# Altium schematic sheet Micron-6.SchDoc: Ультра-Микрон (Микрон-6)
size A4; Date: 03.07.2012; Author: Andrey Bykanov; Engineer: Andrey Bykanov
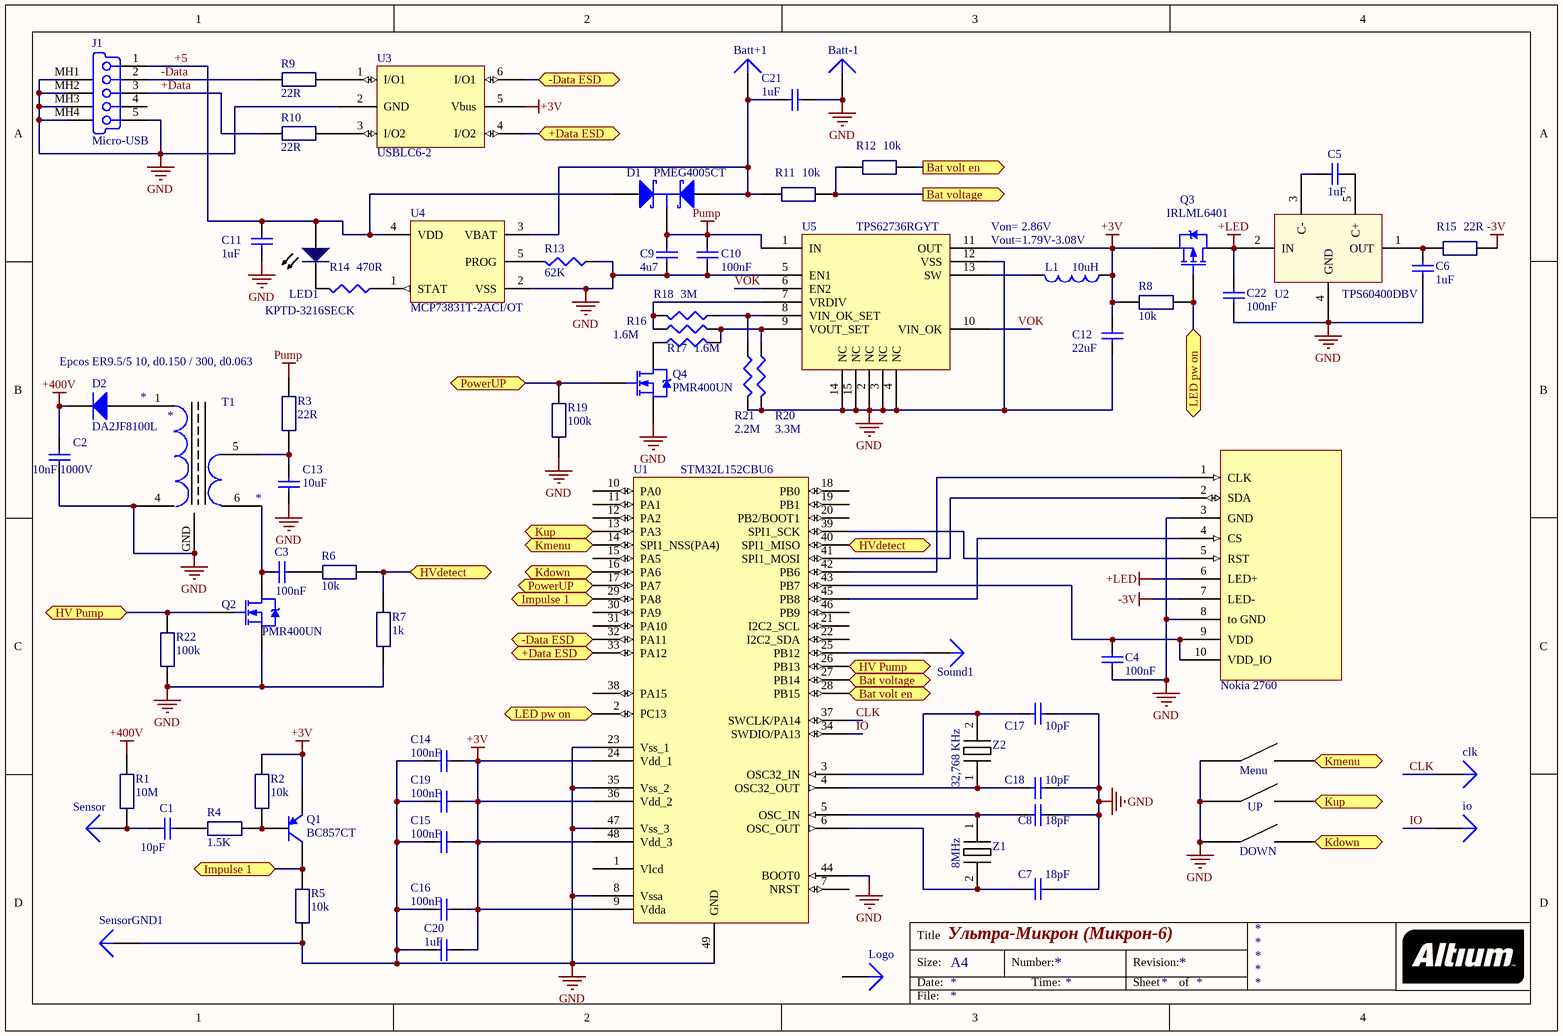
[diagram p0: Micron-6.SchDoc]

## Parts
Batt+1  (no value)  [Sensor contact]
Batt-1  (no value)  [Sensor contact]
C1  10pF  [C1206]
C2  10nF 1000V  [1812]
C3  100nF  [1608[0603]]
C4  100nF  [0402 AVX]
C5  1uF  [0402 AVX]
C6  1uF  [0402 AVX]
C7  18pF  [0402 AVX]
C8  18pF  [0402 AVX]
C9  4u7  [C1206]
C10  100nF  [C1206]
C11  1uF  [0402 AVX]
C12  22uF  [C1206]
C13  10uF  [C1206]
C14  100nF  [0402 AVX]
C15  100nF  [0402 AVX]
C16  100nF  [0402 AVX]
C17  10pF  [0402 AVX]
C18  10pF  [0402 AVX]
C19  100nF  [0402 AVX]
C20  1uF  [0402 AVX]
C21  1uF  [0402 AVX]
C22  100nF  [0402 AVX]
clk  (no value)  [Sensor contact]
D1  PMEG4005CT  [SOT23_N]
D2  DA2JF8100L  [DA2JF8100L]
Display1  Nokia 2760  [DF23C-10DS-0.5V]
io  (no value)  [Sensor contact]
J1  Micro-USB  [47346-0001]
KEY1  Menu  [IT-1187-160GM-G]
KEY2  UP  [IT-1187-160GM-G]
KEY3  DOWN  [IT-1187-160GM-G]
L1  10uH  [IFSC1515AHER100M01]
LED1  KPTD-3216SECK  [KPTD-3216SECK]
Logo  (no value)  [Logo Micron]
Q1  BC857CT  [SOT416_N]
Q2  PMR400UN  [PMR400UN]
Q3  IRLML6401  [Micro3_N]
Q4  PMR400UN  [PMR400UN]
R1  10M  [Yageo HV 1206]
R2  10k  [1608[0603]]
R3  22R  [1608[0603]]
R4  1.5K  [1608[0603]]
R5  10k  [1608[0603]]
R6  10k  [1608[0603]]
R7  1k  [1608[0603]]
R8  10k  [1608[0603]]
R9  22R  [1608[0603]]
R10  22R  [1608[0603]]
R11  10k  [1608[0603]]
R12  10k  [1608[0603]]
R13  62K  [J1-0603]
R14  470R  [1608[0603]]
R15  22R  [1608[0603]]
R16  1.6M  [J1-0603]
R17  1.6M  [J1-0603]
R18  3M  [J1-0603]
R19  100k  [1608[0603]]
R20  3.3M  [J1-0603]
R21  2.2M  [J1-0603]
R22  100k  [1608[0603]]
Sensor  (no value)  [Sensor contact]
SensorGND1  (no value)  [Sensor contact]
Sound1  (no value)  [Sensor contact]
T1  Epcos ER9.5/5 10, d0.150 / 300, d0.063  [Epcos ER9.5/5]
U1  STM32L152CBU6  [UFQFPN48_M]
U2  TPS60400DBV  [SOT-23-OT5_M]
U3  USBLC6-2  [SOT23-6L]
U4  MCP73831T-2ACI/OT  [SOT-23-OT5_N]
U5  TPS62736RGYT  [TPS62736RGYT]
Z1  8MHz  [8MHZ]
Z2  32,768 KHz  [ABS10]

## Ports
+Data ESD, +Data ESD (bidir), -Data ESD, -Data ESD (bidir), Bat volt en (out), Bat voltage (out), HV Pump, HVdetect, Impulse 1, Kdown, Kmenu, Kup, LED pw on, PowerUP

## Nets
+3V: C12.2 C14.1 C15.1 C16.1 C19.1 C20.1 L1.1 Q1.2(E) Q3.2(S) R2.1(A) R8.2 U1.9(Vdda) U1.24(Vdd_1) U1.36(Vdd_2) U1.48(Vdd_3) U3.5(Vbus) U5.11(OUT)
+400V: C2.2 D2.2(K) R1.2
+LED: C22.1 Display1.6(LED+) Q3.3(D) U2.2(IN)
-3V: Display1.7(LED-) R15.1(A)
GND: Batt-1.1 C2.1 C4.2 C6.1 C7.1 C8.2 C9.1 C10.1 C11.1 C12.1 C13.1 C14.2 C15.2 C16.2 C17.1 C18.1 C19.2 C20.2 C21.1 C22.2 Display1.3(GND) Display1.8(to_GND) J1.5(GND) J1.MH1(Tab) J1.MH2(Tab) J1.MH3(Tab) J1.MH4(Tab) KEY1.3 KEY2.3 KEY3.3 Q2.2(S) Q4.2(S) R5.2 R7.1(A) R13.1 R19.1(A) R20.2 R21.2 R22.2 SensorGND1.1 T1.4 T1.GND U1.8(Vssa) U1.23(Vss_1) U1.35(Vss_2) U1.44(BOOT0) U1.47(Vss_3) U1.49(GND) U2.4(GND) U3.2(GND) U4.2(VSS) U5.2(NC) U5.3(NC) U5.4(NC) U5.5(EN1) U5.12(VSS) U5.14(NC) U5.15(NC)
Pump: C9.2 C10.2 D1.3(K) R3.1(A) U5.1(IN)
+5: C11.2 D1.1(A1) J1.1(V_BUS_(5V)) LED1.2 U4.4(VDD)
+Data: J1.3(D+) R10.2
+Data ESD: U1.33(PA12) U3.4(I/O2) ; port +Data ESD
-Data: J1.2(D-) R9.2
-Data ESD: U1.32(PA11) U3.6(I/O1) ; port -Data ESD
Bat volt en: R12.1(A) U1.28(PB15) ; port Bat volt en
Bat voltage: R11.1(A) R12.2 U1.27(PB14) ; port Bat voltage
CLK: clk.1 U1.37(SWCLK/PA14)
HV Pump: Q2.1(G) R22.1(A) U1.26(PB13) ; port HV Pump
HVdetect: R6.2 R7.2 U1.40(SPI1_MISO) ; port HVdetect
Impulse 1: Q1.3(C) R5.1(A) U1.29(PA8) ; port Impulse 1
IO: io.1 U1.34(SWDIO/PA13)
Kdown: KEY3.4 U1.16(PA6) ; port Kdown
Kmenu: KEY1.4 U1.14(SPI1_NSS(PA4)) ; port Kmenu
Kup: KEY2.4 U1.13(PA3) ; port Kup
LED pw on: Q3.1(G) R8.1(A) U1.2(PC13) ; port LED pw on
PowerUP: Q4.1(G) R19.2 U1.17(PA7) ; port PowerUP
VOK: U5.6(EN2) U5.10(VIN_OK)
NetBatt+1_1: Batt+1.1 C21.2 D1.2(A2) R11.2 U4.3(VBAT)
NetC1_1: C1.1 R4.1(A)
NetC1_2: C1.2 R1.1(A) Sensor.1
NetC3_1: C3.1 R6.1(A)
NetC3_2: C3.2 Q2.3(D) T1.6
NetC4_1: C4.1 Display1.9(VDD) Display1.10(VDD_IO) U1.43(PB7)
NetC5_1: C5.1 U2.5(C+)
NetC5_2: C5.2 U2.3(C-)
NetC6_2: C6.2 R15.2 U2.1(OUT)
NetC7_2: C7.2 U1.6(OSC_OUT) Z1.2
NetC8_1: C8.1 U1.5(OSC_IN) Z1.1
NetC13_2: C13.2 R3.2 T1.5
NetC17_2: C17.2 U1.3(OSC32_IN) Z2.2
NetC18_2: C18.2 U1.4(OSC32_OUT) Z2.1
NetD2_1: D2.1(A) T1.1
NetDisplay1_1: Display1.1(CLK) U1.42(PB6)
NetDisplay1_2: Display1.2(SDA) U1.41(SPI1_MOSI)
NetDisplay1_4: Display1.4(CS) U1.45(PB8)
NetDisplay1_5: Display1.5(RST) U1.39(SPI1_SCK)
NetL1_2: L1.2 U5.13(SW)
NetLED1_1: LED1.1 R14.2
NetQ1_1: Q1.1(B) R2.2 R4.2
NetQ4_3: Q4.3(D) R17.1
NetR9_1: R9.1(A) U3.1(I/O1)
NetR10_1: R10.1(A) U3.3(I/O2)
NetR13_2: R13.2 U4.5(PROG)
NetR14_1: R14.1 U4.1(STAT)
NetR16_1: R16.1 R18.2 U5.7(VRDIV)
NetR16_2: R16.2 R17.2 R20.1 U5.9(VOUT_SET)
NetR18_1: R18.1 R21.1 U5.8(VIN_OK_SET)
NetSound1_1: Sound1.1 U1.25(PB12)

Not connected (* = marked no-connect by the designer): J1 4(NC); Logo 1; U1 1(Vlcd) 7(NRST) 10(PA0) 11(PA1) 12(PA2) 15(PA5) 18(PB0) 19(PB1) 20(PB2/BOOT1) 21(I2C2_SCL) 22(I2C2_SDA) 30(PA9) 31(PA10) 38(PA15) 46(PB9)

## Notes on the sheet
- Vout=1.79V-3.08V
- Von= 2.86V
- (near T1) *
- Title
- Size:
- Date:
- A4
- Number:
- Time:
- Revision:
- Sheet
- of
- File:

## Library data of the parts
Batt+1 = Plug: Order: EEMB LP401230; LatestRevisionDate: 17-Jul-2002; LatestRevisionNote: Re-released for DXP Platform.; Publisher: Altium Limited
Batt-1 clk io Logo SensorGND1 = Plug: LatestRevisionDate: 17-Jul-2002; LatestRevisionNote: Re-released for DXP Platform.; Publisher: Altium Limited
C1 = Cap Semi: Capacitor (Semiconductor SIM Model); Order: CC1206JRNPOBBN100; Published: 8-Jun-2000; LatestRevisionDate: 29-May-2009; LatestRevisionNote: IPC-7351 Footprint Added.; PackageReference: C1206; Publisher: Altium Limited; PackageDescription: Chip Capacitor; Value: 10pF
C2 = Cap Semi: Capacitor (Semiconductor SIM Model); Order: 1812AC103KAT1A; Published: 8-Jun-2000; LatestRevisionDate: 29-May-2009; LatestRevisionNote: IPC-7351 Footprint Added.; PackageReference: C1812; Publisher: Altium Limited; PackageDescription: Chip Capacitor; Value: 10nF 1000V
C3 = Cap Semi: Capacitor (Semiconductor SIM Model); Order: GRM188R71E104KA01D; Published: 8-Jun-2000; LatestRevisionDate: 29-May-2009; LatestRevisionNote: IPC-7351 Footprint Added.; PackageReference: C1206; Publisher: Altium Limited; PackageDescription: Chip Capacitor; Value: 100nF
C4 C14-C16 C19 C22 = Cap Semi: Capacitor (Semiconductor SIM Model); Order: 0402ZD104KAT2A; Published: 8-Jun-2000; LatestRevisionDate: 29-May-2009; LatestRevisionNote: IPC-7351 Footprint Added.; PackageReference: C1206; Publisher: Altium Limited; PackageDescription: Chip Capacitor; Value: 100nF
C5 C6 C11 C20 = Cap Semi: Capacitor (Semiconductor SIM Model); Order: CC0402KRX5R5BB105; Avail: 1; Published: 8-Jun-2000; LatestRevisionDate: 29-May-2009; LatestRevisionNote: IPC-7351 Footprint Added.; PackageReference: C1206; Publisher: Altium Limited; PackageDescription: Chip Capacitor; Value: 1uF
C7 C8 = Cap Semi: Capacitor (Semiconductor SIM Model); Order: GRM1555C1H180JZ01D; Published: 8-Jun-2000; LatestRevisionDate: 29-May-2009; LatestRevisionNote: IPC-7351 Footprint Added.; PackageReference: C1206; Publisher: Altium Limited; PackageDescription: Chip Capacitor; Value: 18pF
C9 = CAPACITOR: Capacitor (Semiconductor SIM Model); Order: CC1206KKX7R8BB475; Avail: 1; Published: 8-Jun-2000; LatestRevisionDate: 29-May-2009; LatestRevisionNote: IPC-7351 Footprint Added.; PackageReference: C1206; Publisher: Altium Limited; PackageDescription: Chip Capacitor; Value: 4u7
C10 = CAPACITOR: Capacitor (Semiconductor SIM Model); Order: CC1206KKX7R0BB104; Avail: 1; Published: 8-Jun-2000; LatestRevisionDate: 29-May-2009; LatestRevisionNote: IPC-7351 Footprint Added.; PackageReference: C1206; Publisher: Altium Limited; PackageDescription: Chip Capacitor; Value: 100nF
C12 = CAPACITOR: Capacitor (Semiconductor SIM Model); Order: GRM31CR61E226KE15L; Published: 8-Jun-2000; LatestRevisionDate: 29-May-2009; LatestRevisionNote: IPC-7351 Footprint Added.; PackageReference: C1206; Publisher: Altium Limited; PackageDescription: Chip Capacitor; Value: 22uF
C13 = Cap Semi: Capacitor (Semiconductor SIM Model); Order: GRM31CR61A106KA01L; Published: 8-Jun-2000; LatestRevisionDate: 29-May-2009; LatestRevisionNote: IPC-7351 Footprint Added.; PackageReference: C1206; Publisher: Altium Limited; PackageDescription: Chip Capacitor; Value: 10uF
C17 C18 = Cap Semi: Capacitor (Semiconductor SIM Model); Order: GRM1555C1H100JA01D; Published: 8-Jun-2000; LatestRevisionDate: 29-May-2009; LatestRevisionNote: IPC-7351 Footprint Added.; PackageReference: C1206; Publisher: Altium Limited; PackageDescription: Chip Capacitor; Value: 10pF
C21 = Cap Semi: Capacitor (Semiconductor SIM Model); Order: CC0402KRX5R5BB105; Published: 8-Jun-2000; LatestRevisionDate: 29-May-2009; LatestRevisionNote: IPC-7351 Footprint Added.; PackageReference: C1206; Publisher: Altium Limited; PackageDescription: Chip Capacitor; Value: 1uF
D1 = BAT54C: Schottky Barrier Double Diode; Published: 17-Sep-2003; LatestRevisionDate: 12-Dec-2006; LatestRevisionNote: IPC-7351 Footprint Added.; DatasheetVersion: 4-Mar-2002; PackageVersion: May-1999; PackageReference: SOT23; Publisher: Altium Limited; PackageDescription: 3-Pin SOT-23 Package 0.95 mm Pitch, 2.3 mm Lead Span; ComponentLink1Description: Manufacturer Link; ComponentLink1URL: http://www.semiconductors.philips.com/; ComponentLink2Description: Datasheet; ComponentLink2URL: http://www.semiconductors.philips.com/acrobat/datasheets/BAT54_SERIES_4.pdf; Order: PMEG4005CT
D2 = Diode: Default Diode; Published: 8-Jun-2000; LatestRevisionDate: 17-Jul-2002; LatestRevisionNote: Re-released for DXP Platform.; PackageVersion: Sep-1996; PackageReference: SMC; Publisher: Altium Limited; PackageDescription: DO-214-AB/SMC; 2 C-Bend Leads; Body 7.9 x 5.9 mm, inc. leads (LxW); Code_JEDEC: DO-214-AB; Order: DA2JF8100L; Value: DA2JF8100L
Display1 = Nokia 2760: Order: Nokia 2760 ext + Socket Hirose DF23C-10DS-0.5V
J1 = 0481900001: USB On-The-Go (OTG) Mini-B Receptacle, Right Angle, SMT, 0.80mm (.031") Pitch, Solder Tabs with Back Cover, Recessed Type; Order: Molex 47346-0001
KEY1-KEY3 = Micro_key_smd: Order: IT-1187-160GM-G
L1 = Inductor: Code_IEC: 1005; Avail: 15(или заказ у производителя); Published: 8-Jun-2000; LatestRevisionDate: 29-May-2009; LatestRevisionNote: IPC-7351 Footprint Added.; PackageReference: 0402-A; Publisher: Altium Limited; PackageDescription: Chip Inductor; Code_JEITA: 0402; Value: 10uH; Order: IFSC1515AHER100M01
LED1 = KPTD-3216SECK: Avail: 1; Order: KPTD-3216SECK
Q1 = BC857CT: PNP General-purpose Transistor; Published: 17-Sep-2003; LatestRevisionDate: 12-Dec-2006; LatestRevisionNote: IPC-7351 Footprint Added.; DatasheetVersion: 15-Nov-2000; PackageVersion: Apr-1999; PackageReference: SOT416; Publisher: Altium Limited; PackageDescription: 3-Pin SOT-416 Package 0.50 mm Pitch, 1.6 mm Lead Span; Code_JEITA: SC-75; ComponentLink1Description: Manufacturer Link; ComponentLink1URL: http://www.semiconductors.philips.com/; ComponentLink2Description: Datasheet; ComponentLink2URL: http://www.semiconductors.philips.com/acrobat/datasheets/BC856T_857T_SERIES_3.pdf; order: BC857CT; value: BC857CT
Q2 Q4 = IRLML2402: HEXFET Power MOSFET; Published: 8-Jun-2000; LatestRevisionDate: 20-Nov-2009; LatestRevisionNote: IPC-7351 Footprint Added.; DatasheetVersion: Aug-1997; PackageReference: SOT-23; Publisher: Altium Limited; PackageDescription: 3-Pin SOT-23 Package 0.95 mm Pitch, 2.3 mm Lead Span; ComponentLink1Description: Manufacturer Link; ComponentLink1URL: http://www.irf.com/; ComponentLink2Description: Datasheet; ComponentLink2URL: http://www.irf.com/product-info/datasheets/data/irlml2402.pdf; Order: PMR400UN; Value: PMR400UN
Q3 = IRLML6401: HEXFET Power MOSFET; Published: 17-Sep-2003; DatasheetVersion: 2-Jul-2001; PackageVersion: Jul-2001; PackageReference: Micro3; Publisher: Altium Limited; PackageDescription: 3-Pin SOT-23 Package 0.95 mm Pitch, 2.3 mm Lead Span; ComponentLink1Description: Manufacturer Link; ComponentLink1URL: http://www.irf.com/; ComponentLink2Description: Datasheet; ComponentLink2URL: http://www.irf.com/product-info/datasheets/data/IRLML6401.pdf; Order: IRLML6401; Value: IRLML6401
R1 = Resistor 0805: Model: RV1206JR-0710ML; Order: RV1206JR-0710ML; Value: 10M
R2 R5 R6 R8 = Resistor 0805: Order: RC0603FR-1010KL; Value: 10k
R3 R9 R10 R15 = Resistor 0805: Order: CR0603-JW-220GLF; Avail: 20; Value: 22R
R4 = Resistor 0805: Order: RC0603FR-071K5L; Avail: 1; Value: 1.5K
R7 = Resistor 0805: Order: RC0603FR-101KL; Value: 1k
R11 R12 = Resistor 0805: Order: RC0603FR-1010KL; Avail: 1; Value: 10k
R13 = Res3: Resistor; Order: RC0603JR-0762KL; Avail: 1; Published: 8-Jun-2000; LatestRevisionDate: 29-May-2009; LatestRevisionNote: IPC-7351 Footprint Added.; PackageReference: J1-0603; Publisher: Altium Limited; PackageDescription: Chip Resistor; Value: 62K
R14 = Res3: Resistor; Order: RC0603JR-07470RL; Avail: 1; Published: 8-Jun-2000; LatestRevisionDate: 29-May-2009; LatestRevisionNote: IPC-7351 Footprint Added.; PackageReference: J1-0603; Publisher: Altium Limited; PackageDescription: Chip Resistor; Value: 470R
R16 R17 = Res3: Resistor; Order: RC0603FR-071M6L; Published: 8-Jun-2000; LatestRevisionDate: 29-May-2009; LatestRevisionNote: IPC-7351 Footprint Added.; PackageReference: J1-0603; Publisher: Altium Limited; PackageDescription: Chip Resistor; Value: 1.6M
R18 = Res3: Resistor; Order: RC0603FR-073ML; Published: 8-Jun-2000; LatestRevisionDate: 29-May-2009; LatestRevisionNote: IPC-7351 Footprint Added.; PackageReference: J1-0603; Publisher: Altium Limited; PackageDescription: Chip Resistor; Value: 3M
R19 R22 = Resistor 0805: Order: RC0603FR-10100KL; Value: 100k
R20 = Res3: Resistor; Order: RC0603FR-073M3L; Published: 8-Jun-2000; LatestRevisionDate: 29-May-2009; LatestRevisionNote: IPC-7351 Footprint Added.; PackageReference: J1-0603; Publisher: Altium Limited; PackageDescription: Chip Resistor; Value: 3.3M
R21 = Res3: Resistor; Order: RC0603FR-072M2L; Published: 8-Jun-2000; LatestRevisionDate: 29-May-2009; LatestRevisionNote: IPC-7351 Footprint Added.; PackageReference: J1-0603; Publisher: Altium Limited; PackageDescription: Chip Resistor; Value: 2.2M
Sensor = Plug: Order: SBM-10; LatestRevisionDate: 17-Jul-2002; LatestRevisionNote: Re-released for DXP Platform.; Publisher: Altium Limited
Sound1 = Plug: Order: 7BB-12-9; LatestRevisionDate: 17-Jul-2002; LatestRevisionNote: Re-released for DXP Platform.; Publisher: Altium Limited
T1 = Epcos ER9.5/5: Order: B65523J0000R087 + B65527B1008T001 + B65527A2000X000
U2 = TPS60400: Order: TPS60400DBV
U3 = USBLC6-2: Avail: 1; Order: USBLC6-2
U4 = MCP73831T-2ACI/OT: Miniature Single-Cell, Fully Integrated Li-Ion, Li-Polymer Charge Management Controller, 4.2V, 5-Pin SOT-23, Industrial Temperature, Tape and Reel; Avail: 1; Published: 29-Jan-2009; LatestRevisionDate: 27-Nov-2009; LatestRevisionNote: Updated to datasheet revision E, Sep-2008; DatasheetVersion: revE, Sep-2008; PackageVersion: revBB, Aug-2009; PackageReference: SOT-23-OT5; Publisher: Altium Limited; PackageDescription: 5-Lead Plastic Small Outline Transistor (OT) [SOT-23]; Supplier 1: Digi-Key; Supplier Part Number 1: MCP73831T-2ACI/OTTR-ND; Supplier 2: Digi-Key; Supplier Part Number 2: MCP73831T-2ACI/OTCT-ND; Supplier 3: Digi-Key; Supplier Part Number 3: MCP73831T-2ACI/OTDKR-ND; Supplier 4: Farnell; Supplier Part Number 4: 1332158; Code_IPC: SOT23-5; ComponentLink1Description: Datasheet; ComponentLink1URL: http://ww1.microchip.com/downloads/en/DeviceDoc/21984e.pdf; ComponentLink2Description: Packaging Specification; ComponentLink2URL: http://www.microchip.com/stellent/groups/techpub_sg/documents/packagingspec/en012702.pdf; ComponentLink3Description: Microchip.com Home; ComponentLink3URL: http://www.microchip.com/; Order: MCP73831T-2ACI/OT
U5 = TPS62736RGYT: Avail: 20; Order: TPS62736RGYT
Z1 = 8MHZ: Order: ABM7-8.000MHZ-D2Y-T; Value: 8MHz
Z2 = 8MHZ: Order: ABS10-32.768KHZ-7-T; Value: 32,768 KHz
U1 = STM32L152CBU6: Order: STM32L152CBU6